# EAGLE design logic_swerve (EAGLE 9.5.0)

## Sheet 1 of 5: mBed Breakout
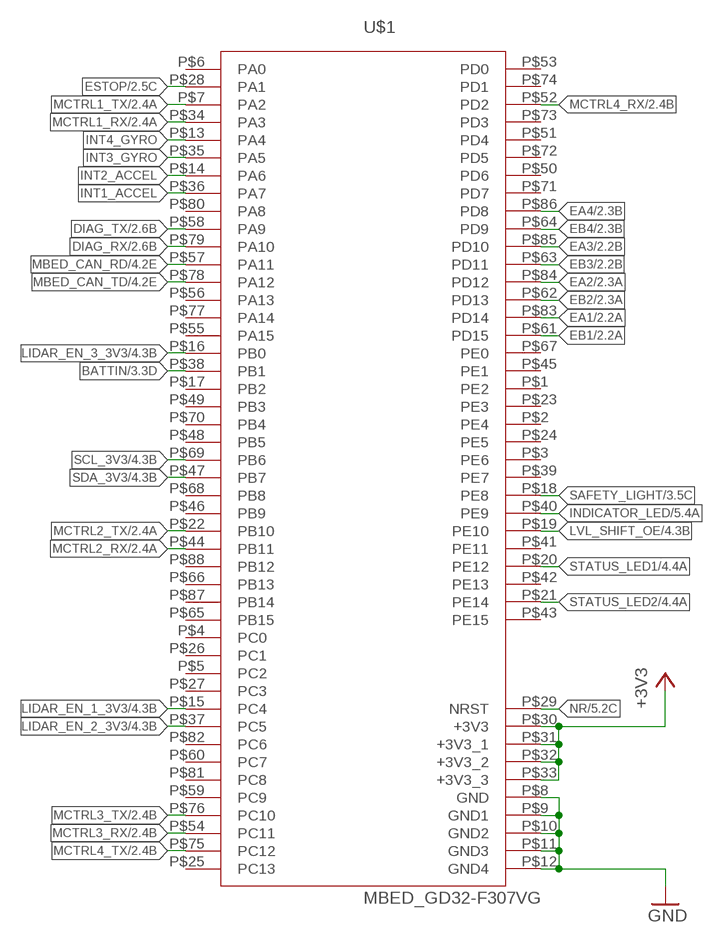
[diagram p0: schematic, sheet 1]

### Parts
U$1  MBED_GD32-F307VG  [SWERVE_MBED]

### Nets
+3V3: U$1.P$30(+3V3) U$1.P$31(+3V3_1) U$1.P$32(+3V3_2) U$1.P$33(+3V3_3) ; also sheet 3,5
BATTIN: U$1.P$38(PB1) ; also sheet 3
DIAG_RX: U$1.P$79(PA10) ; also sheet 2
DIAG_TX: U$1.P$58(PA9) ; also sheet 2
EA1: U$1.P$83(PD14) ; also sheet 2
EA2: U$1.P$84(PD12) ; also sheet 2
EA3: U$1.P$85(PD10) ; also sheet 2
EA4: U$1.P$86(PD8) ; also sheet 2
EB1: U$1.P$61(PD15) ; also sheet 2
EB2: U$1.P$62(PD13) ; also sheet 2
EB3: U$1.P$63(PD11) ; also sheet 2
EB4: U$1.P$64(PD9) ; also sheet 2
ESTOP: U$1.P$28(PA1) ; also sheet 2
GND: U$1.P$8(GND) U$1.P$9(GND1) U$1.P$10(GND2) U$1.P$11(GND3) U$1.P$12(GND4) ; also sheet 2,3,4,5
INDICATOR_LED: U$1.P$40(PE9) ; also sheet 5
INT1_ACCEL: U$1.P$36(PA7)
INT2_ACCEL: U$1.P$14(PA6)
INT3_GYRO: U$1.P$35(PA5)
INT4_GYRO: U$1.P$13(PA4)
LIDAR_EN_1_3V3: U$1.P$15(PC4) ; also sheet 4
LIDAR_EN_2_3V3: U$1.P$37(PC5) ; also sheet 4
LIDAR_EN_3_3V3: U$1.P$16(PB0) ; also sheet 4
LVL_SHIFT_OE: U$1.P$19(PE10) ; also sheet 4
MBED_CAN_RD: U$1.P$57(PA11) ; also sheet 4
MBED_CAN_TD: U$1.P$78(PA12) ; also sheet 4
MCTRL1_RX: U$1.P$34(PA3) ; also sheet 2
MCTRL1_TX: U$1.P$7(PA2) ; also sheet 2
MCTRL2_RX: U$1.P$44(PB11) ; also sheet 2
MCTRL2_TX: U$1.P$22(PB10) ; also sheet 2
MCTRL3_RX: U$1.P$54(PC11) ; also sheet 2
MCTRL3_TX: U$1.P$76(PC10) ; also sheet 2
MCTRL4_RX: U$1.P$52(PD2) ; also sheet 2
MCTRL4_TX: U$1.P$75(PC12) ; also sheet 2
NR: U$1.P$29(NRST) ; also sheet 5
SAFETY_LIGHT: U$1.P$18(PE8) ; also sheet 3
SCL_3V3: U$1.P$69(PB6) ; also sheet 4
SDA_3V3: U$1.P$47(PB7) ; also sheet 4
STATUS_LED1: U$1.P$20(PE12) ; also sheet 4
STATUS_LED2: U$1.P$21(PE14) ; also sheet 4
Unconnected: U$1.P$1(PE2) U$1.P$2(PE4) U$1.P$3(PE6) U$1.P$4(PC0) U$1.P$5(PC2) U$1.P$6(PA0) U$1.P$17(PB2) U$1.P$23(PE3) U$1.P$24(PE5) U$1.P$25(PC13) U$1.P$26(PC1) U$1.P$27(PC3) U$1.P$39(PE7) U$1.P$41(PE11) U$1.P$42(PE13) U$1.P$43(PE15) U$1.P$45(PE1) U$1.P$46(PB9) U$1.P$48(PB5) U$1.P$49(PB3) U$1.P$50(PD6) U$1.P$51(PD4) U$1.P$53(PD0) U$1.P$55(PA15) U$1.P$56(PA13) U$1.P$59(PC9) U$1.P$60(PC7) U$1.P$65(PB15) U$1.P$66(PB13) U$1.P$67(PE0) U$1.P$68(PB8) U$1.P$70(PB4) U$1.P$71(PD7) U$1.P$72(PD5) U$1.P$73(PD3) U$1.P$74(PD1) U$1.P$77(PA14) U$1.P$80(PA8) U$1.P$81(PC8) U$1.P$82(PC6) U$1.P$87(PB14) U$1.P$88(PB12)

## Sheet 2 of 5: Motor Control
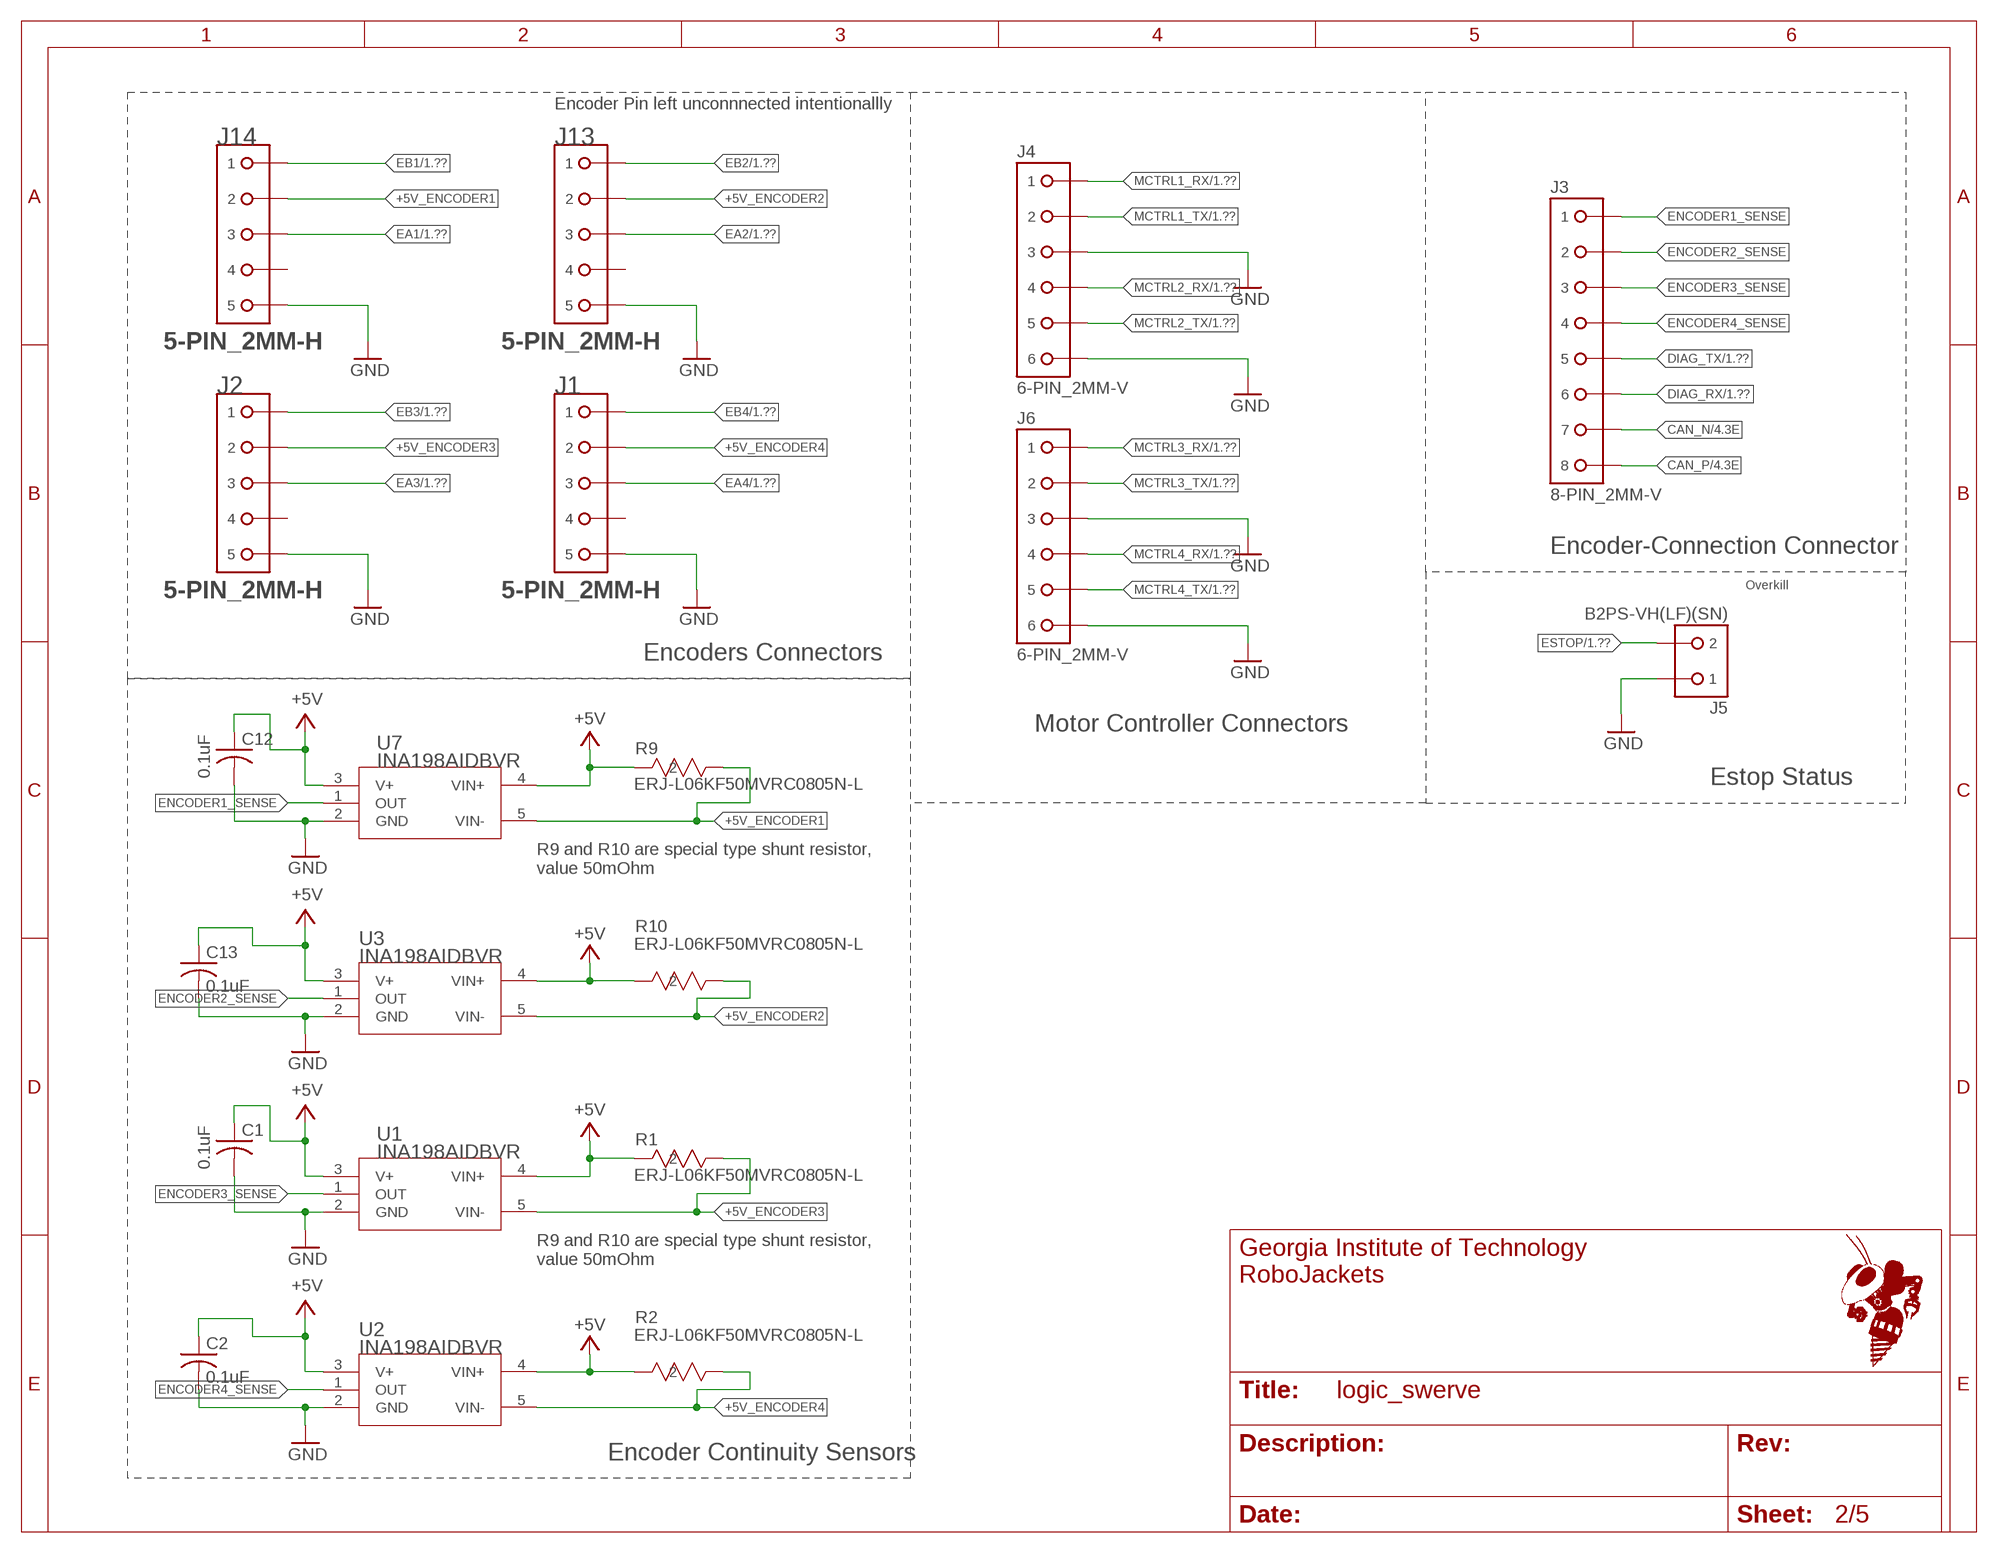
[diagram p1: schematic, sheet 2]

### Parts
C1  0.1uF  C-USC0603  [C0603]
C2  0.1uF  C-USC0603  [C0603]
C12  0.1uF  C-USC0603  [C0603]
C13  0.1uF  C-USC0603  [C0603]
J1  5-PIN_2MM-H  [2MM-5-H]
J2  5-PIN_2MM-H  [2MM-5-H]
J3  8-PIN_2MM-V  [2MM-8-V]
J4  6-PIN_2MM-V  [2MM-6-V]
J5  B2PS-VH(LF)(SN)  [B2PS-CENTERED]
J6  6-PIN_2MM-V  [2MM-6-V]
J13  5-PIN_2MM-H  [2MM-5-H]
J14  5-PIN_2MM-H  [2MM-5-H]
R1  ERJ-L06KF50MVRC0805N-L  [RC0805N-L]
R2  ERJ-L06KF50MVRC0805N-L  [RC0805N-L]
R9  ERJ-L06KF50MVRC0805N-L  [RC0805N-L]
R10  ERJ-L06KF50MVRC0805N-L  [RC0805N-L]
U1  INA198AIDBVR  [DBV5]
U2  INA198AIDBVR  [DBV5]
U3  INA198AIDBVR  [DBV5]
U7  INA198AIDBVR  [DBV5]

### Nets
+5V: C1.1 C2.1 C12.1 C13.1 R1.2 R2.2 R9.2 R10.2 U1.3(V+) U1.4(VIN+) U2.3(V+) U2.4(VIN+) U3.3(V+) U3.4(VIN+) U7.3(V+) U7.4(VIN+) ; also sheet 3,4,5
+5V_ENCODER1: J14.2 R9.1 U7.5(VIN-)
+5V_ENCODER2: J13.2 R10.1 U3.5(VIN-)
+5V_ENCODER3: J2.2 R1.1 U1.5(VIN-)
+5V_ENCODER4: J1.2 R2.1 U2.5(VIN-)
CAN_N: J3.7 ; also sheet 4
CAN_P: J3.8 ; also sheet 4
DIAG_RX: J3.6 ; also sheet 1
DIAG_TX: J3.5 ; also sheet 1
EA1: J14.3 ; also sheet 1
EA2: J13.3 ; also sheet 1
EA3: J2.3 ; also sheet 1
EA4: J1.3 ; also sheet 1
EB1: J14.1 ; also sheet 1
EB2: J13.1 ; also sheet 1
EB3: J2.1 ; also sheet 1
EB4: J1.1 ; also sheet 1
ENCODER1_SENSE: J3.1 U7.1(OUT)
ENCODER2_SENSE: J3.2 U3.1(OUT)
ENCODER3_SENSE: J3.3 U1.1(OUT)
ENCODER4_SENSE: J3.4 U2.1(OUT)
ESTOP: J5.2 ; also sheet 1
GND: C1.2 C2.2 C12.2 C13.2 J1.5 J2.5 J4.3 J4.6 J5.1 J6.3 J6.6 J13.5 J14.5 U1.2(GND) U2.2(GND) U3.2(GND) U7.2(GND) ; also sheet 1,3,4,5
MCTRL1_RX: J4.1 ; also sheet 1
MCTRL1_TX: J4.2 ; also sheet 1
MCTRL2_RX: J4.4 ; also sheet 1
MCTRL2_TX: J4.5 ; also sheet 1
MCTRL3_RX: J6.1 ; also sheet 1
MCTRL3_TX: J6.2 ; also sheet 1
MCTRL4_RX: J6.4 ; also sheet 1
MCTRL4_TX: J6.5 ; also sheet 1
Unconnected: J1.4 J2.4 J13.4 J14.4

### Notes on the sheet
- Encoder Pin left unconnnected intentionallly
- Encoder-Connection Connector
- Overkill
- Encoders Connectors
- Motor Controller Connectors
- Estop Status
- R9 and R10 are special type shunt resistor,
  value 50mOhm
- R9 and R10 are special type shunt resistor,
  value 50mOhm
- Encoder Continuity Sensors

## Sheet 3 of 5: Light Control
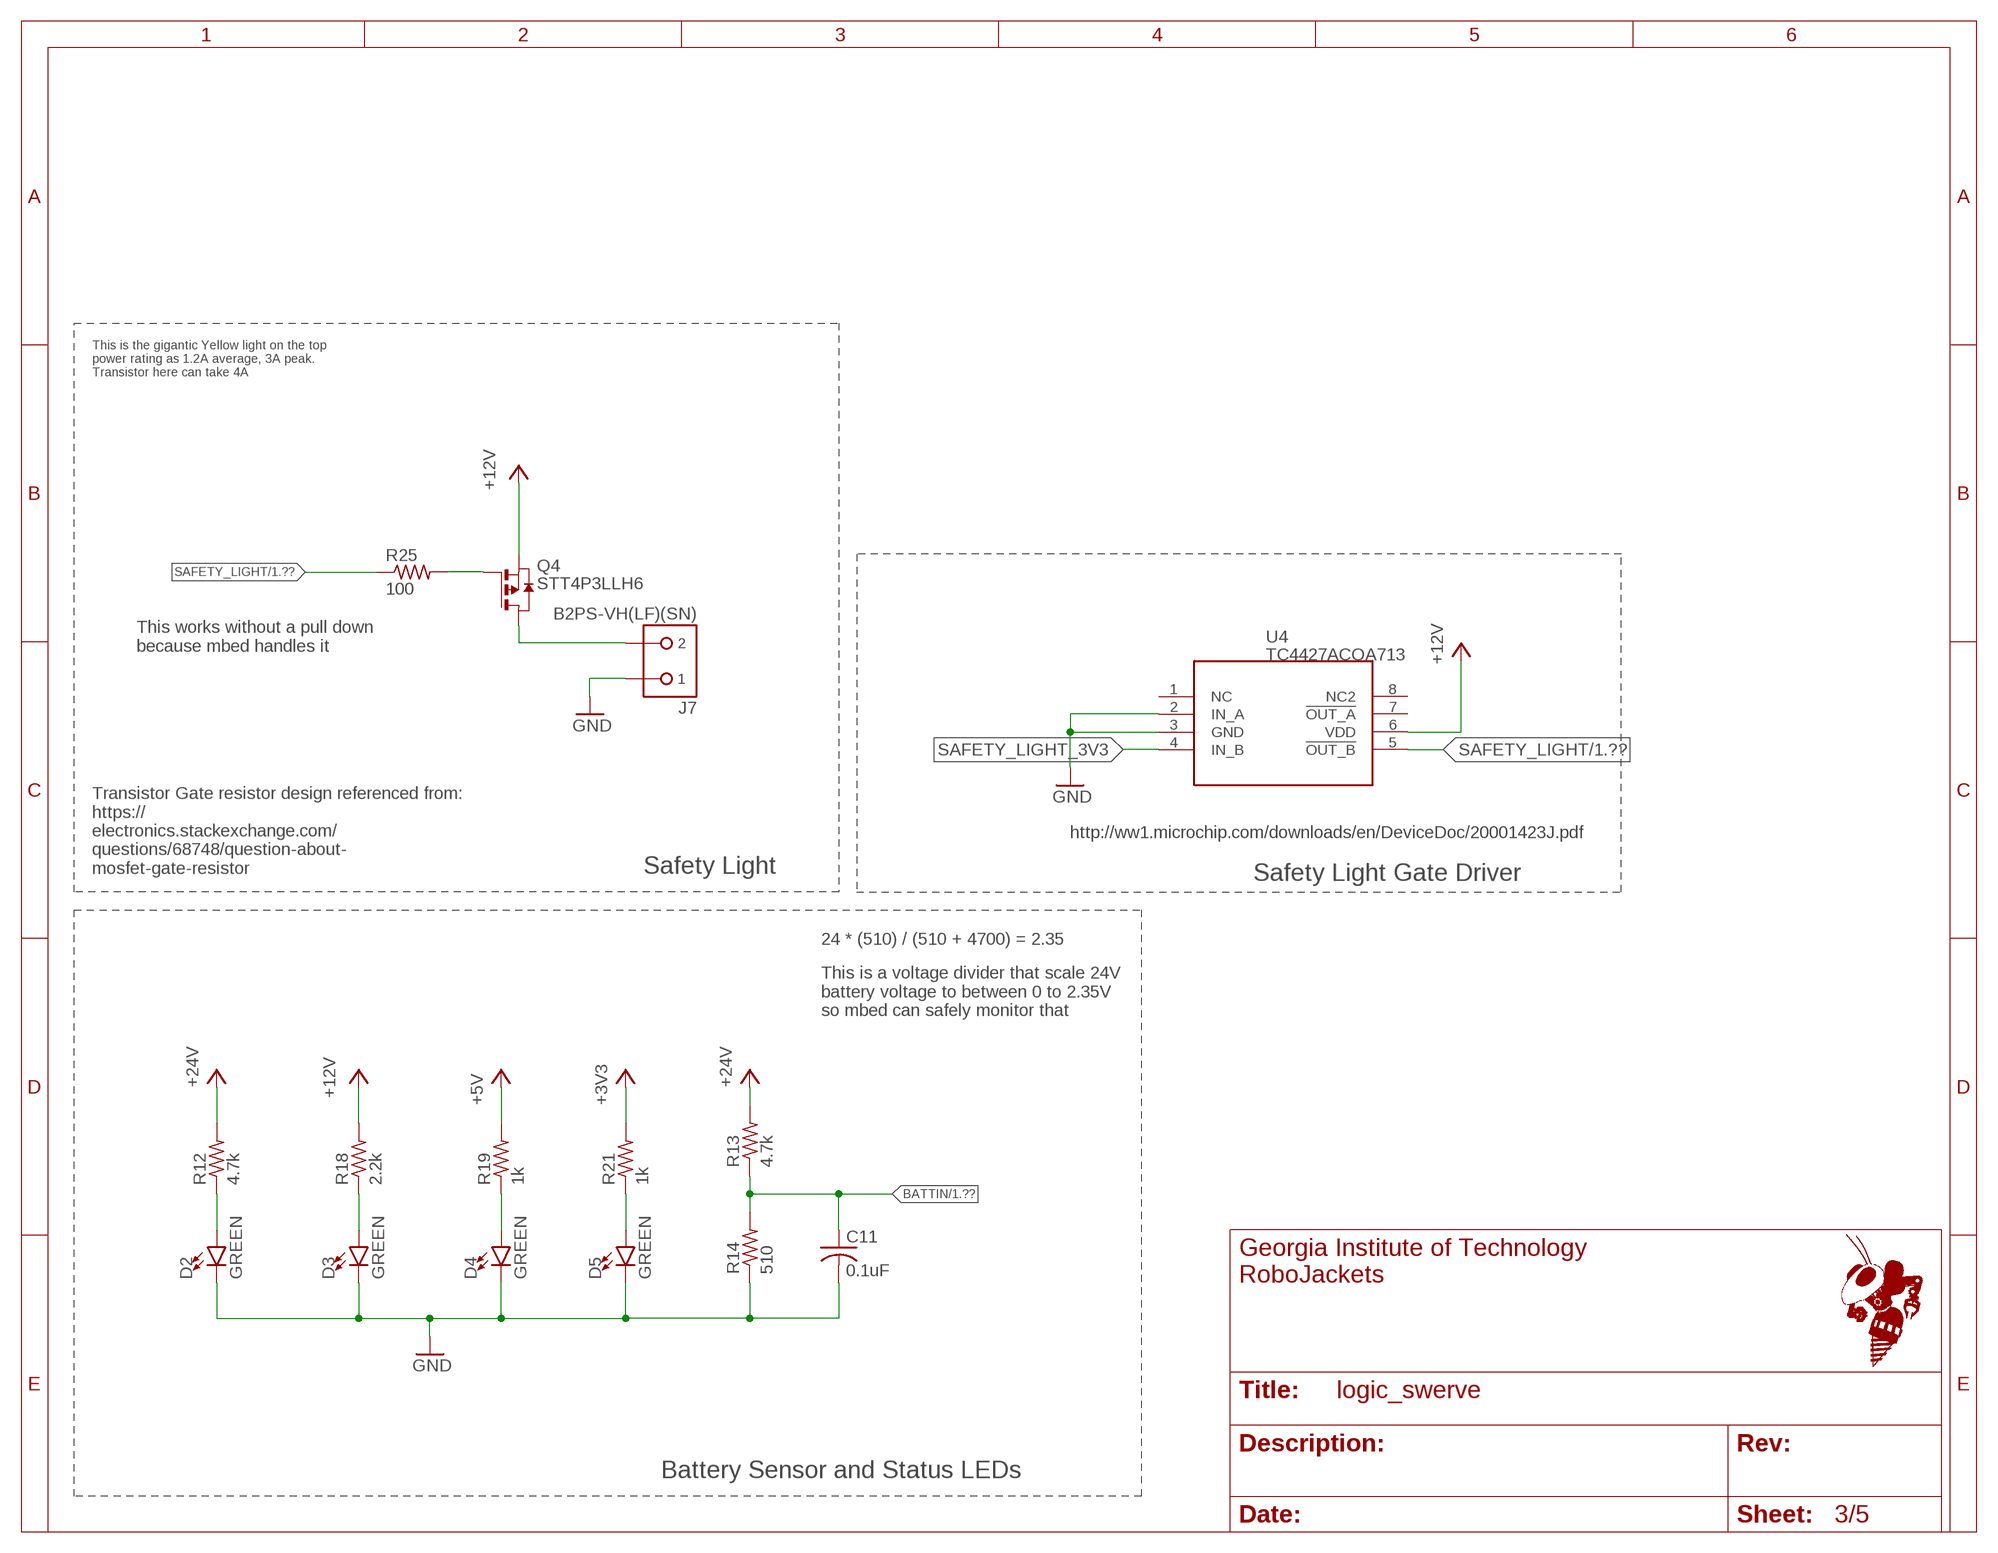
[diagram p2: schematic, sheet 3]

### Parts
C11  0.1uF  C-USC0603  [C0603]
D2  GREEN  LED-BLUE0603  [LED-0603]
D3  GREEN  LED-BLUE0603  [LED-0603]
D4  GREEN  LED-GREEN0603  [LED-0603]
D5  GREEN  LED-GREEN0603  [LED-0603]
J7  B2PS-VH(LF)(SN)  [B2PS-CENTERED]
Q4  STT4P3LLH6  [SOT23-6]
R12  4.7k  R-US_R0603  [R0603]
R13  4.7k  R-US_R0603  [R0603]
R14  510  R-US_R0603  [R0603]
R18  2.2k  R-US_R0603  [R0603]
R19  1k  R-US_R0603  [R0603]
R21  1k  R-US_R0603  [R0603]
R25  100  R-US_R0603  [R0603]
U4  TC4427ACOA713  [SOIC-8]

### Nets
3V3_LED_R: D5.A R21.1
5V_LED_R: D4.A R19.1
12V_LED_R: D3.A R18.1
+3V3: R21.2 ; also sheet 1,5
+5V: R19.2 ; also sheet 2,4,5
+12V: Q4.4(S) R18.2 U4.6(VDD) ; also sheet 5
+24V: R12.2 R13.2 ; also sheet 5
BATTIN: C11.1 R13.1 R14.2 ; also sheet 1
GND: C11.2 D2.C D3.C D4.C D5.C J7.1 R14.1 U4.2(IN_A) U4.3(GND) ; also sheet 1,2,4,5
N$1: D2.A R12.1
SAFETY_HRD: J7.2 Q4.1(D) Q4.2(D) Q4.5(D) Q4.6(D)
SAFETY_LIGHT: R25.1 U4.5(!OUT_B) ; also sheet 1
SAFETY_LIGHT_3V3: U4.4(IN_B)
SAFETY_R: Q4.3(G) R25.2
Unconnected: U4.1(NC) U4.7(!OUT_A) U4.8(NC2)

### Notes on the sheet
- This is the gigantic Yellow light on the top
  power rating as 1.2A average, 3A peak.
  Transistor here can take 4A
- This works without a pull down
  because mbed handles it
- http://ww1.microchip.com/downloads/en/DeviceDoc/20001423J.pdf
- Transistor Gate resistor design referenced from:
  https://
  electronics.stackexchange.com/
  questions/68748/question-about-
  mosfet-gate-resistor
- Safety Light
- Safety Light Gate Driver
- 24 * (510) / (510 + 4700) = 2.35
- This is a voltage divider that scale 24V
  battery voltage to between 0 to 2.35V
  so mbed can safely monitor that
- Battery Sensor and Status LEDs

## Sheet 4 of 5: Sensor and Comm
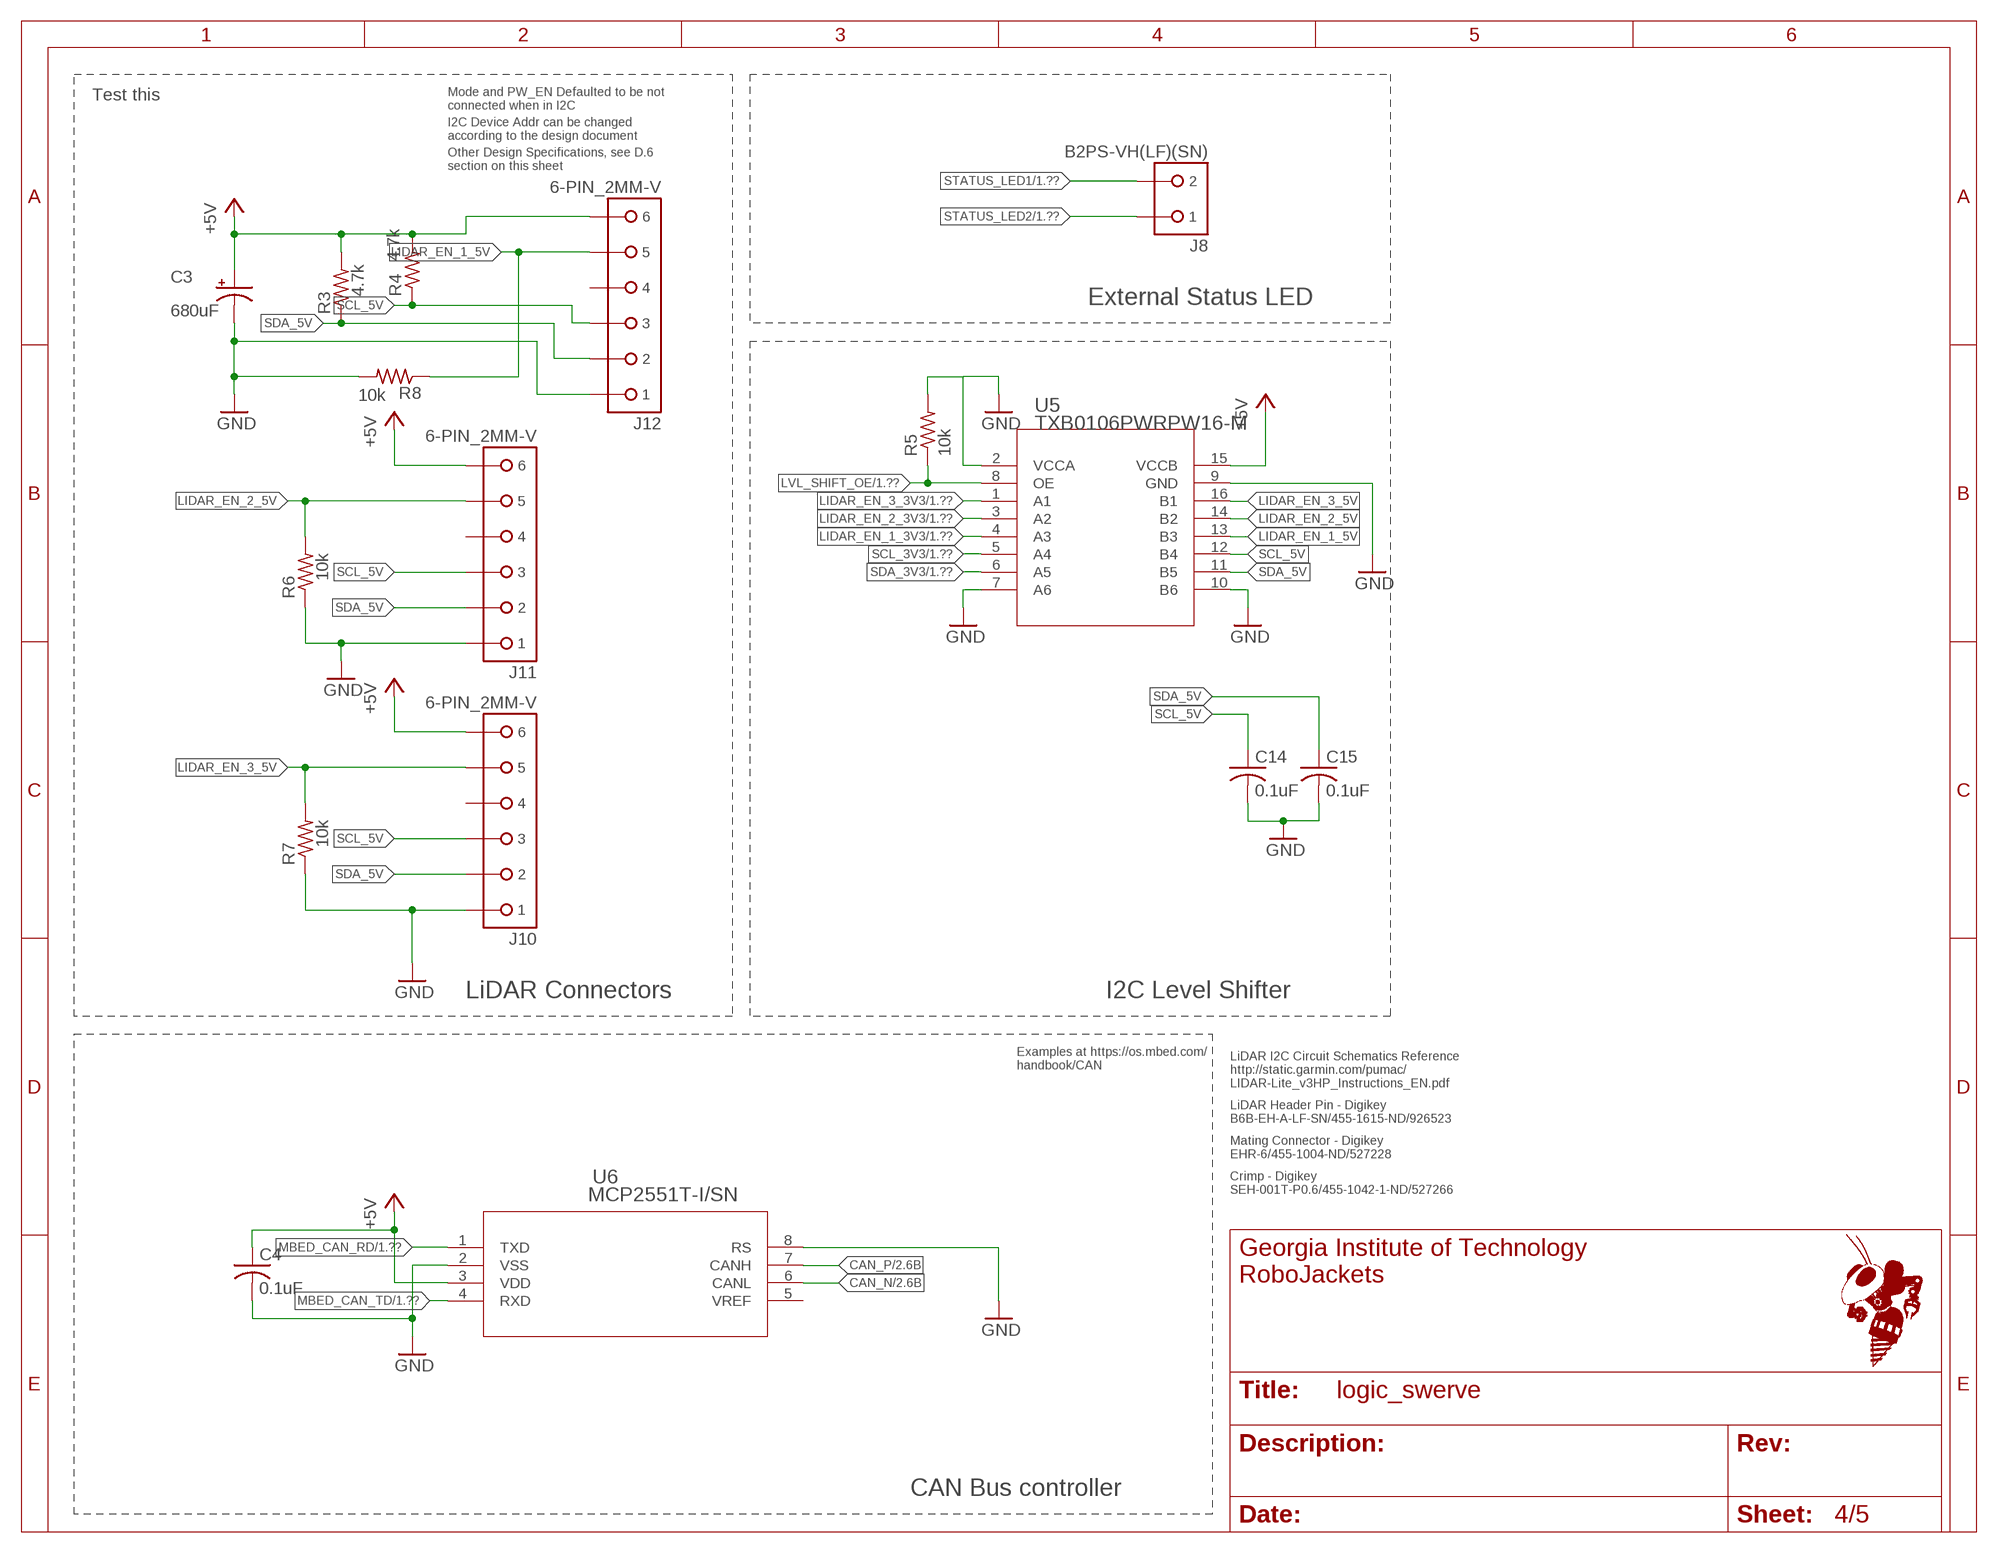
[diagram p3: schematic, sheet 4]

### Parts
C3  680uF  CPOL-USE5-5  [E5-5]
C4  0.1uF  C-USC0603  [C0603]
C14  0.1uF  C-USC0603  [C0603]
C15  0.1uF  C-USC0603  [C0603]
J8  B2PS-VH(LF)(SN)  [B2PS-CENTERED]
J10  6-PIN_2MM-V  [2MM-6-V]
J11  6-PIN_2MM-V  [2MM-6-V]
J12  6-PIN_2MM-V  [2MM-6-V]
R3  4.7k  R-US_R0603  [R0603]
R4  4.7k  R-US_R0603  [R0603]
R5  10k  R-US_R0603  [R0603]
R6  10k  R-US_R0603  [R0603]
R7  10k  R-US_R0603  [R0603]
R8  10k  R-US_R0603  [R0603]
U5  TXB0106PWRPW16-M  [PW16-M]
U6  MCP2551T-I/SN  [SOIC8-N_MC]

### Nets
+5V: C3.+ C4.1 J10.6 J11.6 J12.6 R3.2 R4.2 U5.15(VCCB) U6.3(VDD) ; also sheet 2,3,5
CAN_N: U6.6(CANL) ; also sheet 2
CAN_P: U6.7(CANH) ; also sheet 2
GND: C3.- C4.2 C14.2 C15.2 J10.1 J11.1 J12.1 R5.2 R6.1 R7.1 R8.2 U5.2(VCCA) U5.7(A6) U5.9(GND) U5.10(B6) U6.2(VSS) U6.8(RS) ; also sheet 1,2,3,5
LIDAR_EN_1_3V3: U5.4(A3) ; also sheet 1
LIDAR_EN_1_5V: J12.5 R8.1 U5.13(B3)
LIDAR_EN_2_3V3: U5.3(A2) ; also sheet 1
LIDAR_EN_2_5V: J11.5 R6.2 U5.14(B2)
LIDAR_EN_3_3V3: U5.1(A1) ; also sheet 1
LIDAR_EN_3_5V: J10.5 R7.2 U5.16(B1)
LVL_SHIFT_OE: R5.1 U5.8(OE) ; also sheet 1
MBED_CAN_RD: U6.1(TXD) ; also sheet 1
MBED_CAN_TD: U6.4(RXD) ; also sheet 1
SCL_3V3: U5.5(A4) ; also sheet 1
SCL_5V: C14.1 J10.3 J11.3 J12.3 R4.1 U5.12(B4)
SDA_3V3: U5.6(A5) ; also sheet 1
SDA_5V: C15.1 J10.2 J11.2 J12.2 R3.1 U5.11(B5)
STATUS_LED1: J8.2 ; also sheet 1
STATUS_LED2: J8.1 ; also sheet 1
Unconnected: J10.4 J11.4 J12.4 U6.5(VREF)

### Notes on the sheet
- Test this
- Mode and PW_EN Defaulted to be not
  connected when in I2C
- I2C Device Addr can be changed
  according to the design document
- Other Design Specifications, see D.6
  section on this sheet
- External Status LED
- LiDAR Connectors | I2C Level Shifter
- Examples at https://os.mbed.com/
  handbook/CAN
- LiDAR I2C Circuit Schematics Reference
  http://static.garmin.com/pumac/
  LIDAR-Lite_v3HP_Instructions_EN.pdf
- LiDAR Header Pin - Digikey
  B6B-EH-A-LF-SN/455-1615-ND/926523
- Mating Connector - Digikey
  EHR-6/455-1004-ND/527228
- Crimp - Digikey
  SEH-001T-P0.6/455-1042-1-ND/527266
- CAN Bus controller

## Sheet 5 of 5: Misc
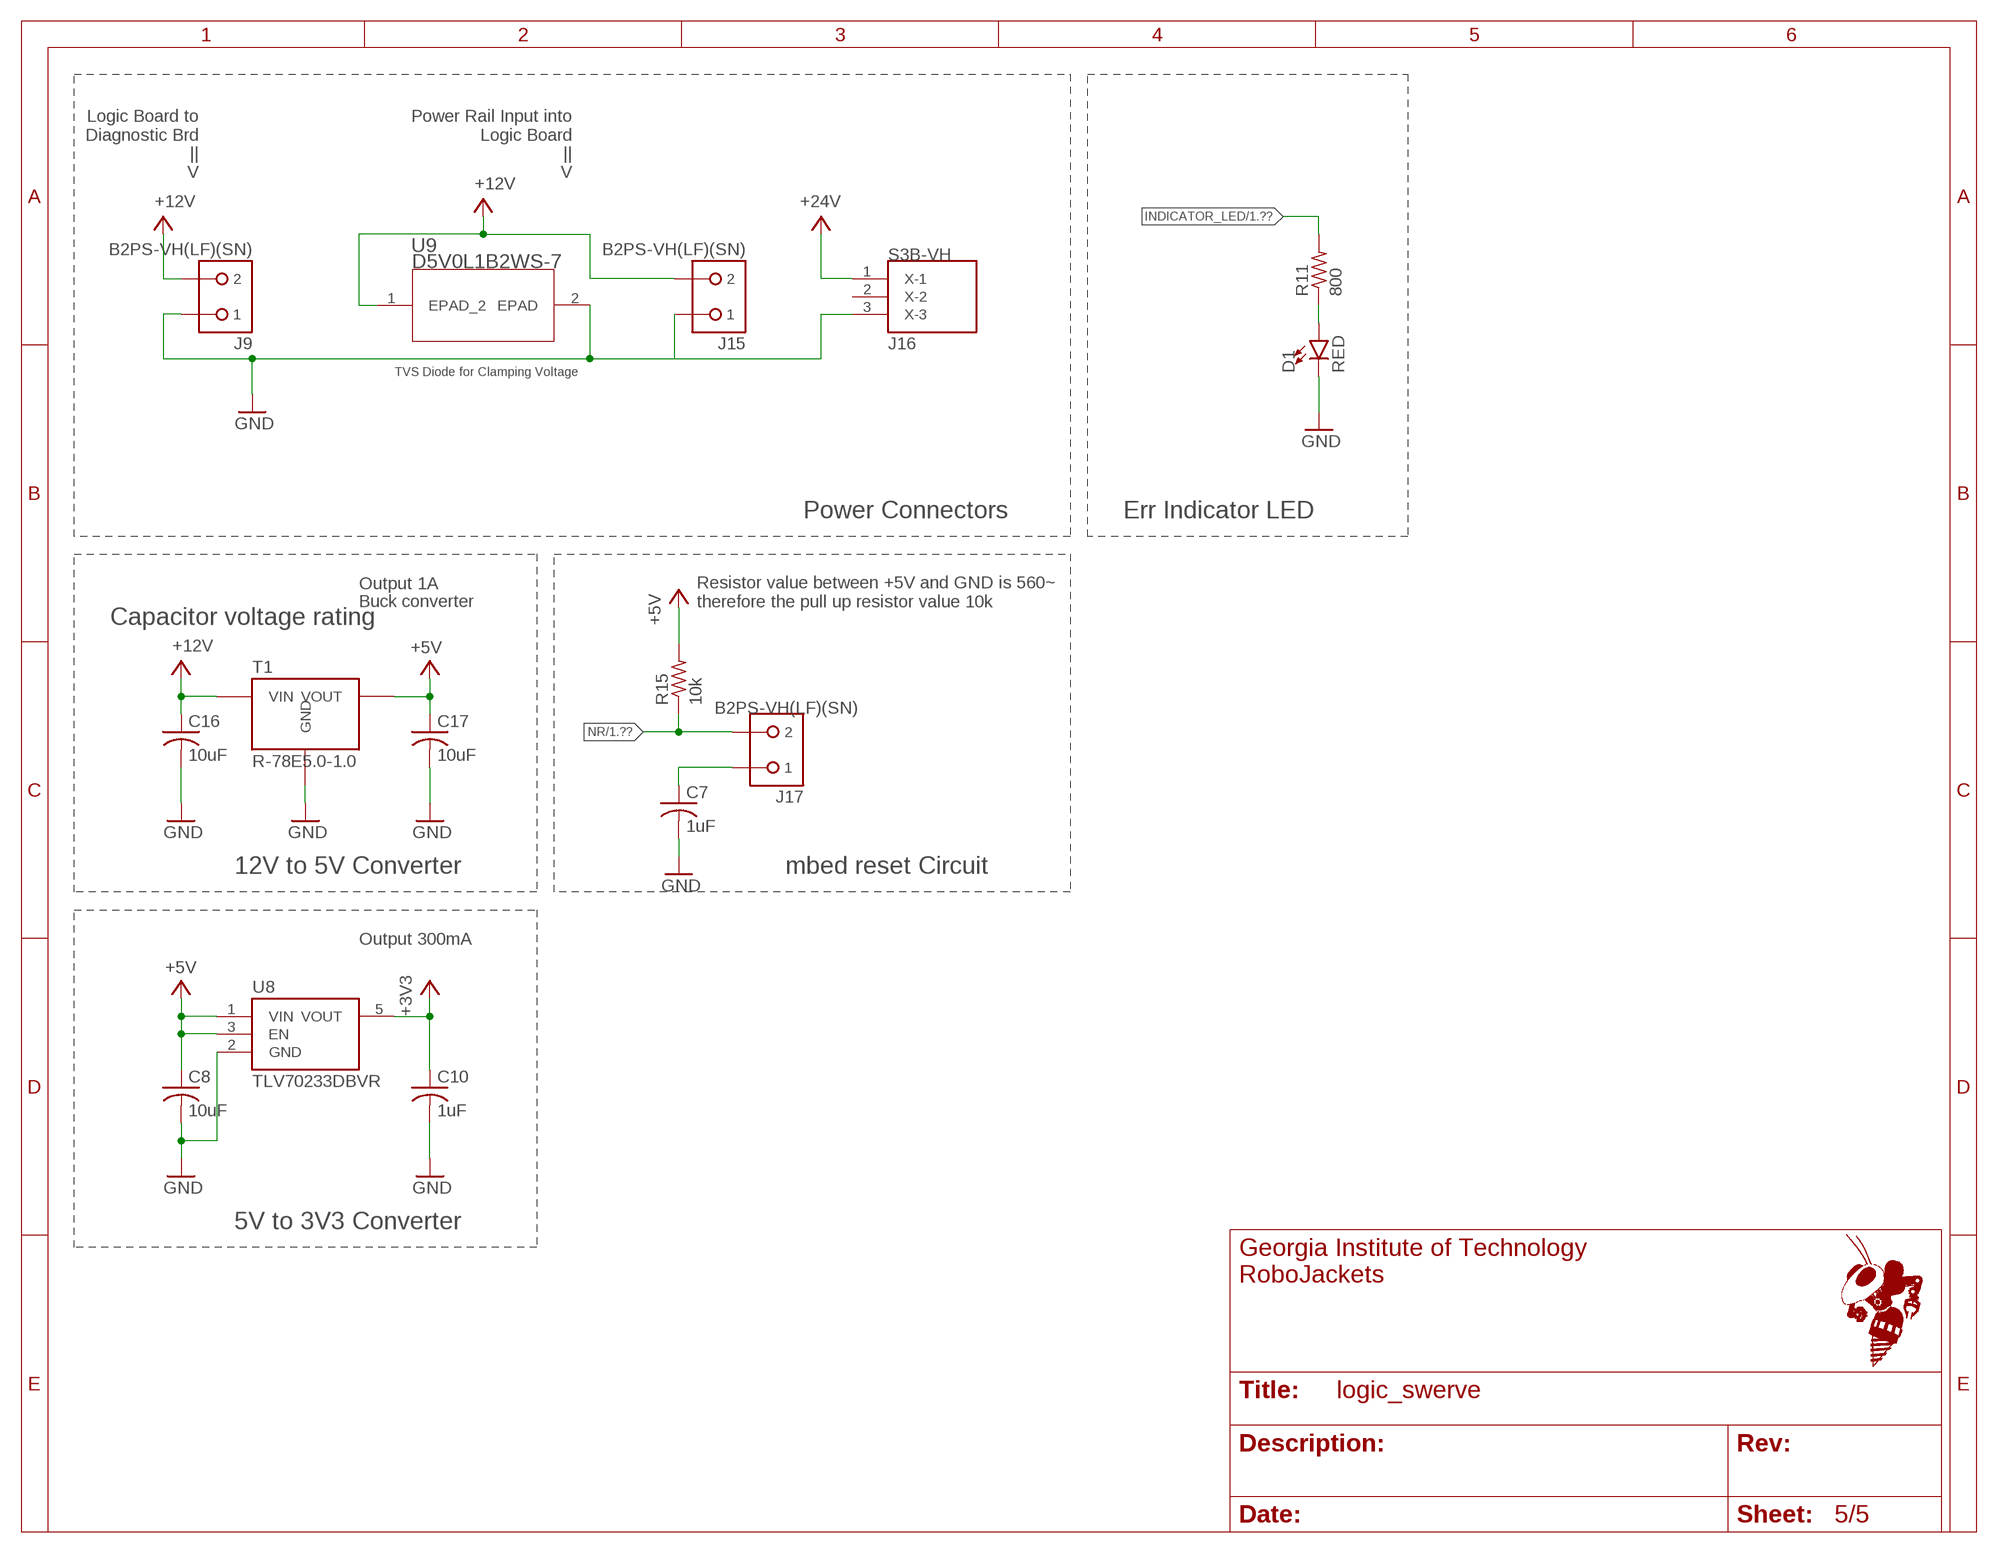
[diagram p4: schematic, sheet 5]

### Parts
C7  1uF  C-USC0805  [C0805]
C8  10uF  C-USC0805  [C0805]
C10  1uF  C-USC0805  [C0805]
C16  10uF  C-USC0805  [C0805]
C17  10uF  C-USC0805  [C0805]
D1  RED  LED-BLUE0603  [LED-0603]
J9  B2PS-VH(LF)(SN)  [B2PS-CENTERED]
J15  B2PS-VH(LF)(SN)  [B2PS-CENTERED]
J16  S3B-VH  [S3B-VH]
J17  B2PS-VH(LF)(SN)  [B2PS-CENTERED]
R11  800  R-US_R0603  [R0603]
R15  10k  R-US_R0603  [R0603]
T1  R-78E5.0-1.0  [R-78E]
U8  TLV70233DBVR  [SOT-23-5]
U9  D5V0L1B2WS-7  [SOD323]

### Nets
+3V3: C10.1 U8.5(VOUT) ; also sheet 1,3
+5V: C8.1 C17.1 R15.2 T1.3(VOUT) U8.1(VIN) U8.3(EN) ; also sheet 2,3,4
+12V: C16.1 J9.2 J15.2 T1.1(VIN) U9.1(EPAD_2) ; also sheet 3
+24V: J16.1(X-1) ; also sheet 3
GND: C7.2 C8.2 C10.2 C16.2 C17.2 D1.C J9.1 J15.1 J16.3(X-3) T1.2(GND) U8.2(GND) U9.2(EPAD) ; also sheet 1,2,3,4
INDICATOR_LED: R11.2 ; also sheet 1
N$2: D1.A R11.1
N$3: C7.1 J17.1
NR: J17.2 R15.1 ; also sheet 1
Unconnected: J16.2(X-2)

### Notes on the sheet
- Logic Board to
  Diagnostic Brd
               ||
               V
- Power Rail Input into
  Logic Board
               ||
               V
- TVS Diode for Clamping Voltage
- Power Connectors | Err Indicator LED
- Output 1A
- Buck converter
- Resistor value between +5V and GND is 560~
  therefore the pull up resistor value 10k
- Capacitor voltage rating
- 12V to 5V Converter | mbed reset Circuit
- Output 300mA
- 5V to 3V3 Converter

## Library data of the parts
C1 C2 C4 C7 C8 C10-C17 = rcl:C-US: CAPACITOR, American symbol; SPICEPREFIX: C
C3 = rcl:CPOL-US: POLARIZED CAPACITOR, American symbol; SPICEPREFIX: C
D1-D3 = SparkFun-LED:LED-BLUE: Blue SMD LED Used in manufacturing of various products at SparkFun Packages: 0603 - SMD 0603 package [Product Link] <http://www.digikey.com/product-detail/en/SMLE12BC7TT86/511-1589-2-ND/1641808> 1206 - SMD1206 package [Product Link] <http://www.digikey.com/product-detail/en/lite-on-inc/LTST-C150TBKT/160-1643-1-ND/573584> SparkFun Products: ESP8266 Thing-Dev Board <https://www.sparkfun.com/products/13711> RedBoard <https://www.sparkfun.com/products/12757>; PROD_ID: DIO-08575; VALUE: BLUE
D4 D5 = SparkFun-LED:LED-GREEN: Green SMD LED Used in manufacturing of various products at SparkFun Packages: 0603 - SMD 0603 package [Product Link] <http://www.futureelectronics.com/en/technologies/semiconductors/optoelectronics/leds/Pages/9894312-LTST-C190GKT.aspx?CrossPart=HSMG-C190&IM=0> LilyPad 1206 - SMD1206 LilyPad package [Product Link] <http://www.futureelectronics.com/en/Technologies/Product.aspx?ProductID=IN150NGHARVATEKCORPORATION2049943&IM=0> 1206 - SMD1206 package [Product Link] <http://www.futureelectronics.com/en/technologies/semiconductors/optoelectronics/leds/Pages/8315665-LTST-C150KGKT.aspx?IM=0> 1206 Bottom Mount -SMD 1206 Bottom Mount [Product Link] <http://www.digikey.com/product-detail/en/lite-on-inc/LTST-C230KGKT/160-1456-1-ND/386854> SparkFun Products: Pro Mini 328 -5V <https://www.sparkfun.com/products/821> RedBoard <https://www.sparkfun.com/products/12757> MP3 Trigger <https://www.sparkfun.com/products/13720> Makey Makey <https://www.sparkfun.com/products/11076>; PROD_ID: DIO-00821
J1 J2 J13 J14 = RoboJackets-Connectors:5-PIN_2MM-*; PINS: 5; PIN_PITCH: 2.0 mm
J3 = RoboJackets-Connectors:8-PIN_2MM-*; PINS: 8; PIN_PITCH: 2.0 mm
J4 J6 J10-J12 = RoboJackets-Connectors:6-PIN_2MM-*; PINS: 6; PIN_PITCH: 2.0 mm
J5 J7-J9 J15 J17 = RoboJackets-Connectors:B2P?-VH(LF)(SN): Power Connector Brand: JST Sales America Inc. <https://www.jst.com/> Series: VH <http://www.digikey.com/product-search/en?FV=fff40016,fff802f3,ffec0e9d> Distributor: Digi-Key <http://www.digikey.com/product-detail/en/B2PS-VH%28LF%29%28SN%29/455-1648-ND/926555>; DIGIKEY: 455-1648-ND; MPN: B2PS-VH(LF)(SN)
J16 = IGVC-Connector:S3B-VH
Q4 = MotorBoardDev:STT4P3LLH6
R1 R2 R9 R10 = IGVC-Discrete:ERJ-L06KF50MV; MANUFACTURER_PART_NUMBER: ERJL06KF50MV; VENDOR: Panasonic
R3-R8 R11-R15 R18 R19 R21 R25 = rcl:R-US_: RESISTOR, American symbol; SPICEPREFIX: R
T1 = MotorBoardDev:R-78E5.0-1.0
U1-U3 U7 = IGVC-Sensor:INA198AIDBVR; MANUFACTURER_PART_NUMBER: INA198AIDBVR; VENDOR: Texas Instruments
U4 = MotorBoardDev:TC4427ACOA713
U5 = IGVC-IC:TXB0106PWR; MANUFACTURER_PART_NUMBER: TXB0106PWR; VENDOR: Texas Instruments
U6 = IGVC-Microcontroller:MCP2551T-I/SN; MANUFACTURER_PART_NUMBER: MCP2551TISN; VENDOR: Microchip
U8 = RoboJackets-PowerICs:TLV70233; DIGIKEY: 296-32415-1-ND; MPN: TLV70233DBVR
U9 = IGVC-Discrete:D5V0L1B2WS-7; BUILT_BY: EMA_UL_Team; MANUFACTURER_PART_NUMBER: D5V0L1B2WS-7; VENDOR: Diodes Inc
U$1 = RoboJackets-Boards:MBED_GD32-F307VG

## Board
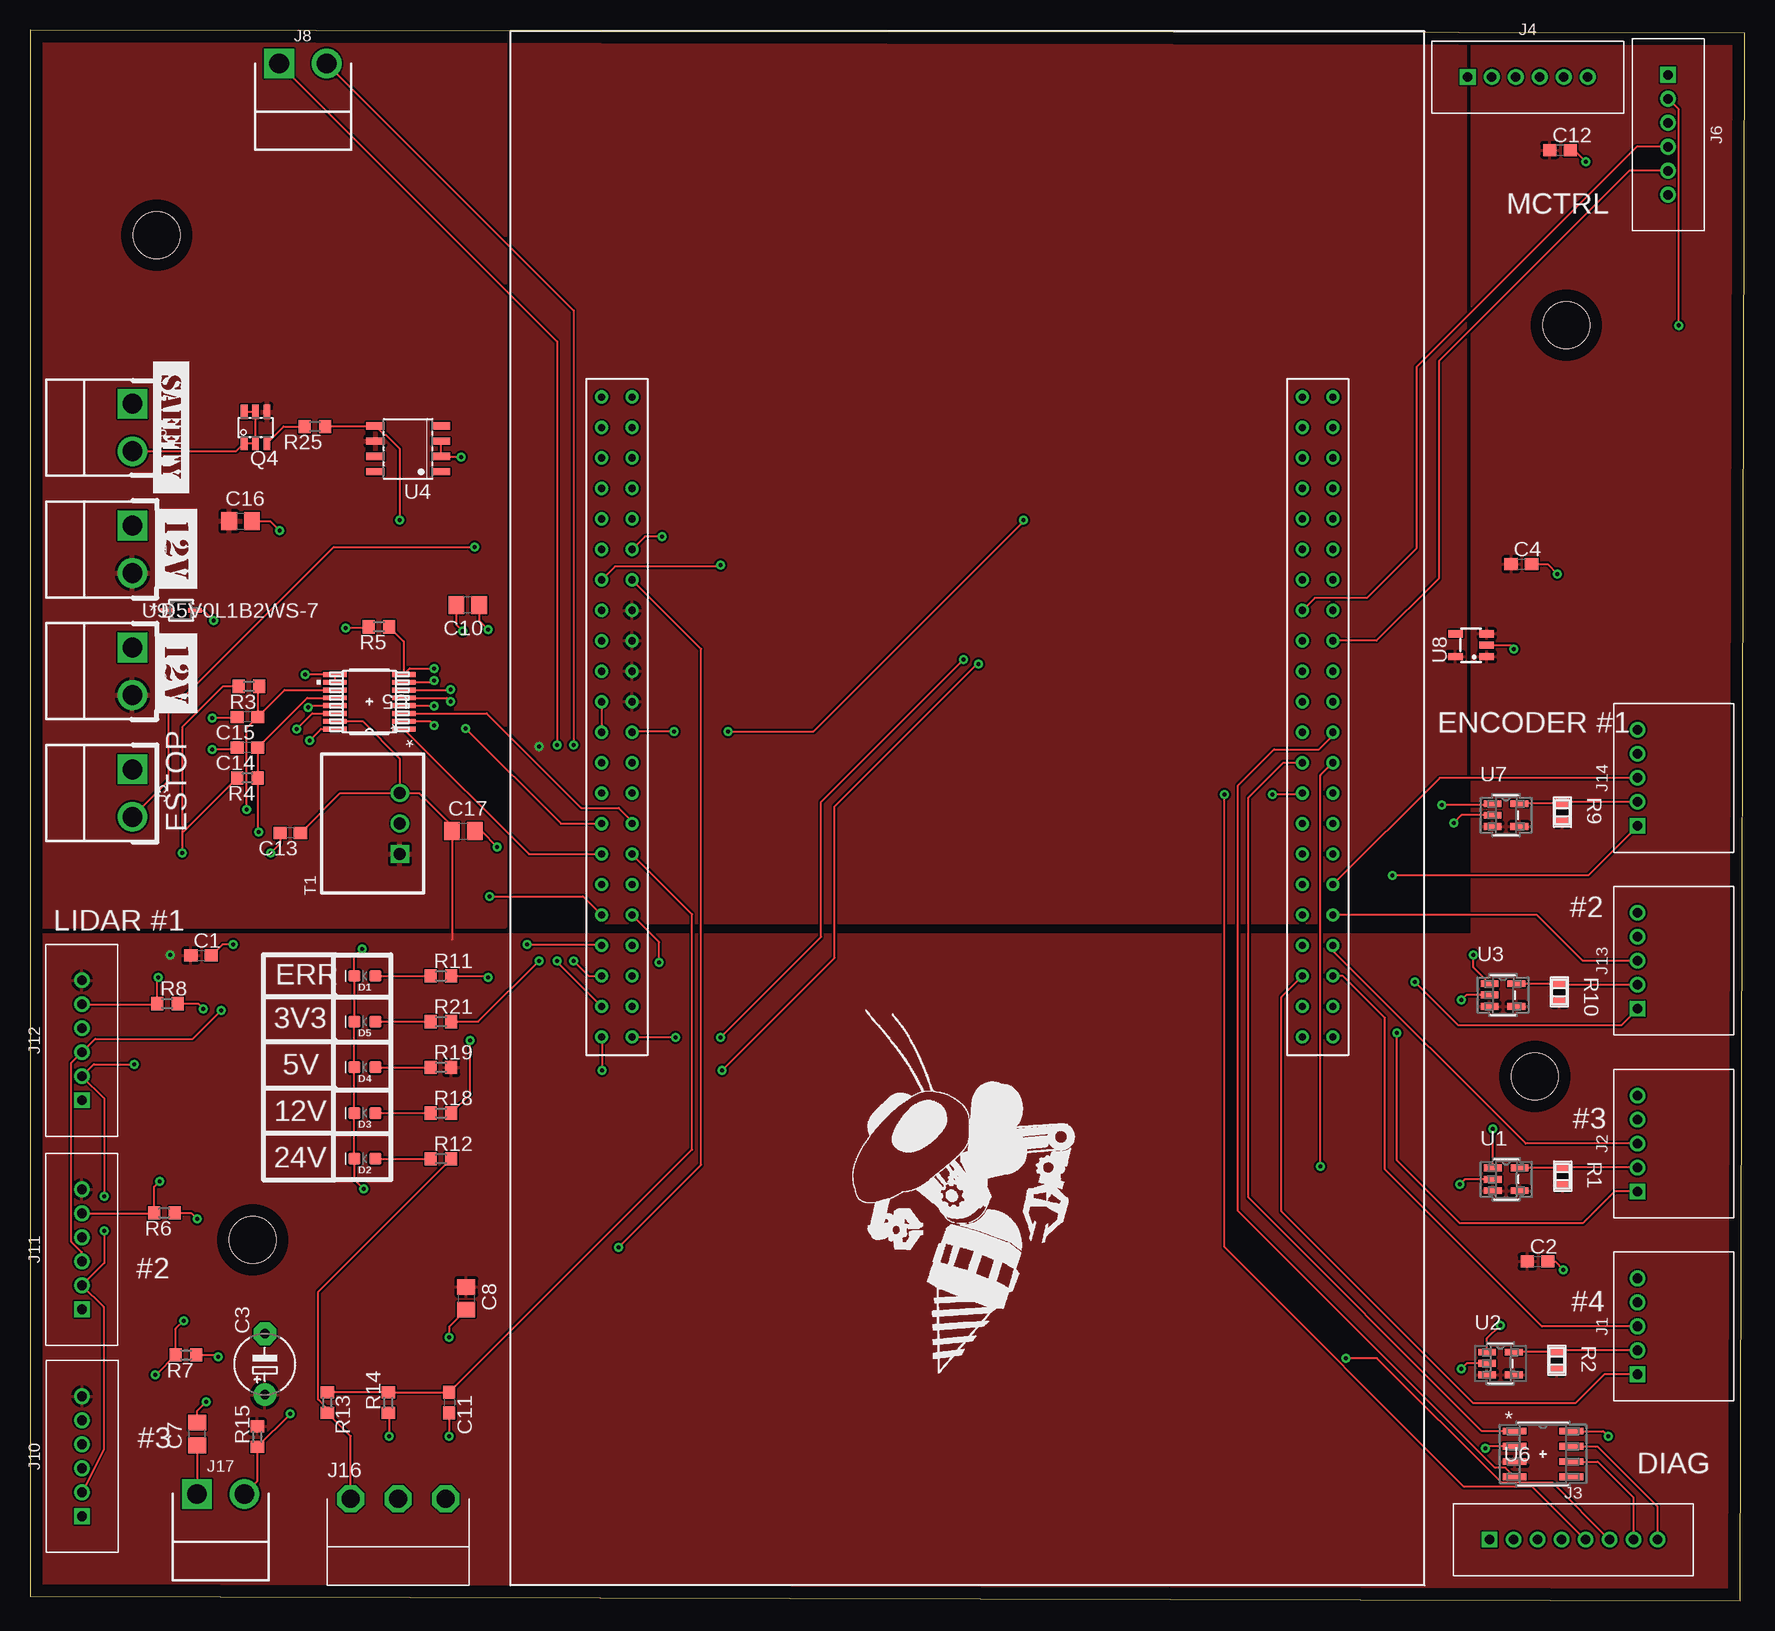
[diagram p5: board, top side]
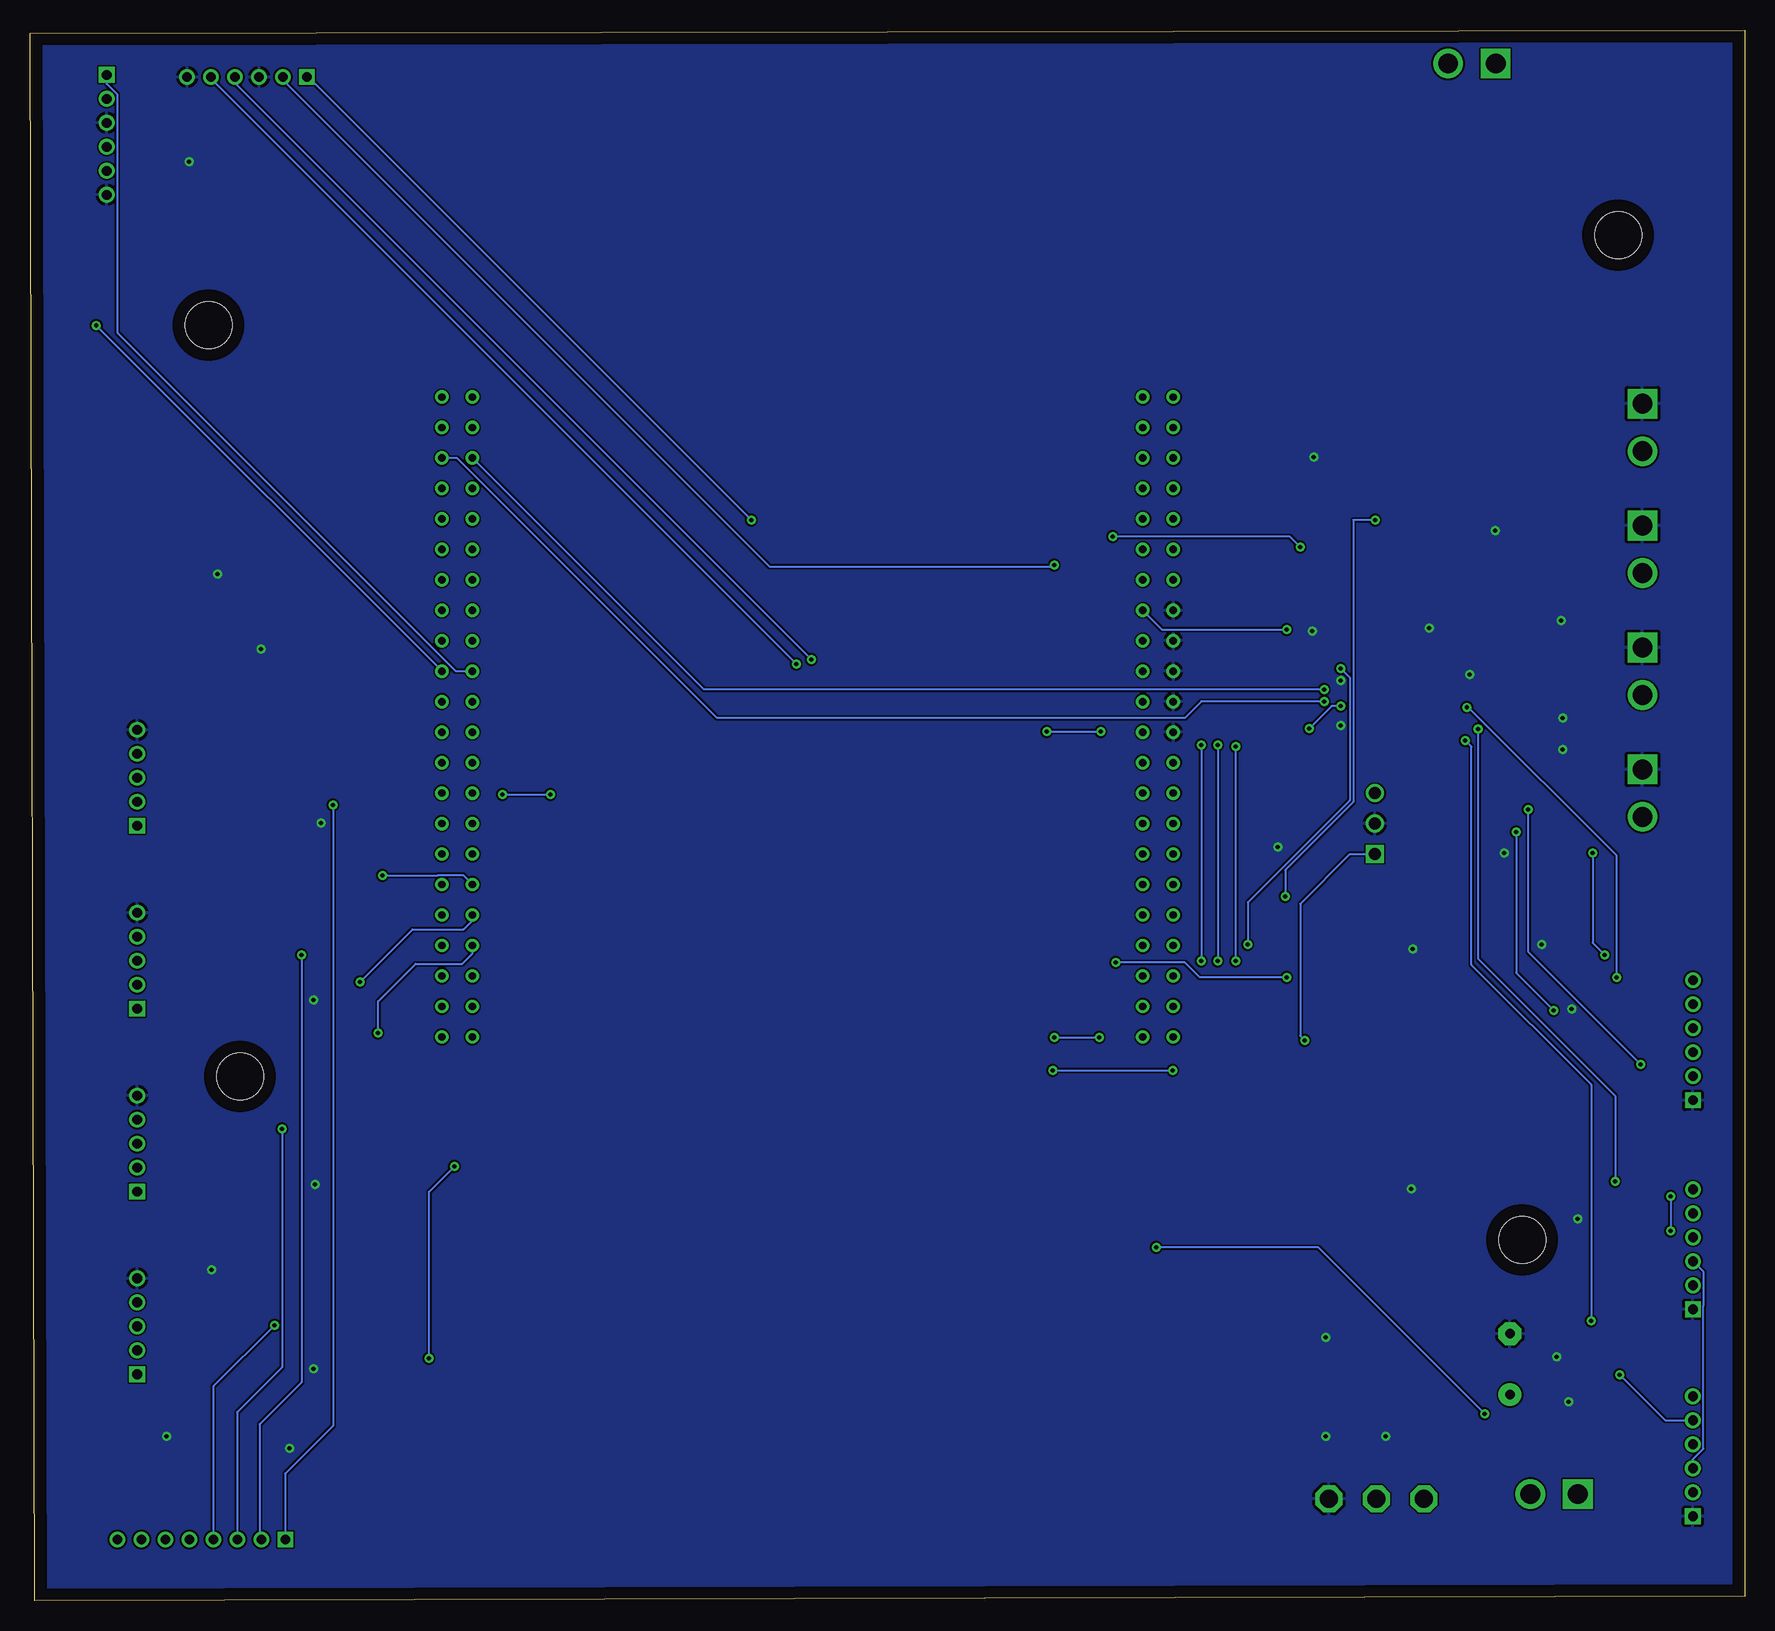
[diagram p6: board, bottom side, seen from below]

Size 142.94 x 130.93 mm. Coordinates in mm from the lower left corner, seen from the top.
Outline: 0,0.38 142.57,0 142.94,130.68 0,130.93 0,0.38
Copper layers (1*16): Top 0.035mm / dielectric 1.5mm / Bottom 0.035mm
Design rules "default": minimum track width 6mil, minimum drill 0.35mm, track to track 6mil, track to pad 6mil, pad to pad 6mil, via to via 6mil, smd to smd 6mil, copper to edge 40mil, drill to drill 6mil, minimum pad ring 10mil, minimum via ring 8mil, stop-mask expansion 4mil, vias tented up to drill 0mil, thermal gap 10mil

### Footprints (pad centres in the part's own frame; a part is rotated, then mirrored left to right if it is on the bottom)
C0603 = smd 1.1 x 1: 1 -0.85,0; 2 0.85,0
E5-5 = drill 0.813 pad 1.905: + -2.54,0 | drill 0.813 pad 1.905 octagon: - 2.54,0
C0805 = smd 1.3 x 1.5: 1 -0.95,0; 2 0.95,0
LED-0603 = smd 1 x 1: A -0.877,0; C 0.877,0
2MM-5-H = drill 0.8 square: 1 -4,0 | drill 0.8: 2 -2,0; 3 0,0; 4 2,0; 5 4,0
2MM-8-V = drill 0.8 square: 1 -6,0 | drill 0.8: 2 -4,0; 3 -2,0; 4 0,0; 5 2,0; 6 4,0; 7 6,0; 8 8,0
2MM-6-V = drill 0.8 square: 1 -4,0 | drill 0.8: 2 -2,0; 3 0,0; 4 2,0; 5 4,0; 6 6,0
B2PS-CENTERED = drill 1.65 square: 1 -1.98,0 | drill 1.65: 2 1.98,0
S3B-VH = drill 1.5 octagon: 1 1.95,7.2; 2 5.91,7.2; 3 9.87,7.2
SOT23-6 = smd 0.55 x 1.2: 1 -0.95,-1.3; 2 0,-1.3; 3 0.95,-1.3; 4 0.95,1.3; 5 0,1.3; 6 -0.95,1.3
RC0805N-L = smd 0.802 x 1.2: 1 0.519,-0.762; 2 2.021,-0.762
R0603 = smd 1 x 1.1: 1 -0.85,0; 2 0.85,0
R-78E = drill 1 square: 1 -2.54,0 | drill 1: 2 0,0; 3 2.54,0
DBV5 = smd 1.473 x 0.559: 1 1.041,-0.574; 2 1.041,-1.524; 3 1.041,-2.474; 4 3.277,-2.474; 5 3.277,-0.574
SOIC-8 = smd 0.61 x 1.52: 1 -1.905,-2.723; 2 -0.635,-2.723; 3 0.635,-2.723; 4 1.905,-2.723; 5 1.905,2.723; 6 0.635,2.723; 7 -0.635,2.723; 8 -1.905,2.723
PW16-M = smd 1.981 x 0.406: 1 -2.87,2.275; 2 -2.87,1.625; 3 -2.87,0.975; 4 -2.87,0.325; 5 -2.87,-0.325; 6 -2.87,-0.975; 7 -2.87,-1.625; 8 -2.87,-2.275; 9 2.87,-2.275; 10 2.87,-1.625; 11 2.87,-0.975; 12 2.87,-0.325; 13 2.87,0.325; 14 2.87,0.975; 15 2.87,1.625; 16 2.87,2.275
SOIC8-N_MC = smd 1.981 x 0.559: 1 -2.362,1.905; 2 -2.362,0.635; 3 -2.362,-0.635; 4 -2.362,-1.905; 5 2.362,-1.905; 6 2.362,-0.635; 7 2.362,0.635; 8 2.362,1.905
SOT-23-5 = smd 0.6 x 1.2: 1 -0.95,-1.306; 2 0,-1.306; 3 0.95,-1.306; 4 0.95,1.306; 5 -0.95,1.306
SOD323 = smd 1.111 x 0.401: 1 -1.15,0; 2 1.15,0
SWERVE_MBED = drill 0.6 pad 1.016: P$1 -30.48,27.94; P$2 -30.48,25.4; P$3 -30.48,22.86; P$4 -30.48,20.32; P$5 -30.48,17.78; P$6 -30.48,15.24; P$7 -30.48,12.7; P$8 -30.48,10.16; P$9 -30.48,7.62; P$10 -30.48,5.08; P$11 -30.48,2.54; P$12 -30.48,0; P$13 -30.48,-2.54; P$14 -30.48,-5.08; P$15 -30.48,-7.62; P$16 -30.48,-10.16; P$17 -30.48,-12.7; P$18 -30.48,-15.24; P$19 -30.48,-17.78; P$20 -30.48,-20.32; P$21 -30.48,-22.86; P$22 -30.48,-25.4; P$23 -27.94,27.94; P$24 -27.94,25.4; P$25 -27.94,22.86; P$26 -27.94,20.32; P$27 -27.94,17.78; P$28 -27.94,15.24; P$29 -27.94,12.7; P$30 -27.94,10.16; P$31 -27.94,7.62; P$32 -27.94,5.08; P$33 -27.94,2.54; P$34 -27.94,0; P$35 -27.94,-2.54; P$36 -27.94,-5.08; P$37 -27.94,-7.62; P$38 -27.94,-10.16; P$39 -27.94,-12.7; P$40 -27.94,-15.24; P$41 -27.94,-17.78; P$42 -27.94,-20.32; P$43 -27.94,-22.86; P$44 -27.94,-25.4; P$45 27.94,27.94; P$46 27.94,25.4; P$47 27.94,22.86; P$48 27.94,20.32; P$49 27.94,17.78; P$50 27.94,15.24; P$51 27.94,12.7; P$52 27.94,10.16; P$53 27.94,7.62; P$54 27.94,5.08; P$55 27.94,2.54; P$56 27.94,0; P$57 27.94,-2.54; P$58 27.94,-5.08; P$59 27.94,-7.62; P$60 27.94,-10.16; P$61 27.94,-12.7; P$62 27.94,-15.24; P$63 27.94,-17.78; P$64 27.94,-20.32; P$65 27.94,-22.86; P$66 27.94,-25.4; P$67 30.48,27.94; P$68 30.48,25.4; P$69 30.48,22.86; P$70 30.48,20.32; P$71 30.48,17.78; P$72 30.48,15.24; P$73 30.48,12.7; P$74 30.48,10.16; P$75 30.48,7.62; P$76 30.48,5.08; P$77 30.48,2.54; P$78 30.48,0; P$79 30.48,-2.54; P$80 30.48,-5.08; P$81 30.48,-7.62; P$82 30.48,-10.16; P$83 30.48,-12.7; P$84 30.48,-15.24; P$85 30.48,-17.78; P$86 30.48,-20.32; P$87 30.48,-22.86; P$88 30.48,-25.4
STANDOFF-HOLE = hole 3.9: 0,0

### Placement (x,y rotation side)
C1  14.26,53.77 0 top
C2  125.66,28.27 0 top
C3  19.58,19.71 90 top
C4  124.31,86.39 0 top
C7  13.94,13.89 90 top
C8  36.36,25.2 270 top
C10  36.48,83 180 top
C11  34.95,16.51 270 top
C12  127.53,120.91 0 top
C13  21.69,64 180 top
C14  18.13,71.12 180 top
C15  18.13,73.66 180 top
C16  17.55,89.98 0 top
C17  36.12,64.14 0 top
D1  27.91,52.07 180 top
D2  27.91,36.83 180 top
D3  27.91,40.64 180 top
D4  27.91,44.45 180 top
D5  27.91,48.26 180 top
J1  134.01,22.86 90 top
J2  134.01,38.1 90 top
J3  127.66,5.08 0 top
J4  123.85,127 0 top
J5  8.53,67.31 270 top
J6  136.55,123.19 270 top
J7  8.53,97.79 270 top
J8  22.75,128.13 0 top
J9  8.53,77.47 270 top
J10  4.33,11.03 90 top
J11  4.33,28.28 90 top
J12  4.33,45.7 90 top
J13  134.01,53.34 90 top
J14  134.01,68.58 90 top
J15  8.53,87.63 270 top
J16  24.79,1.27 0 top
J17  15.9,8.89 0 top
Q4  18.8,97.79 0 top
R1  128.51,36.64 270 top
R2  128.03,21.3 270 top
R3  18.25,76.21 180 top
R4  18.13,68.58 180 top
R5  29.09,81.17 180 top
R6  11.2,32.32 180 top
R7  13.02,20.48 180 top
R8  11.45,49.77 0 top
R9  128.5,67 270 top
R10  128.25,52 270 top
R11  34.27,52.07 0 top
R12  34.27,36.83 0 top
R13  24.79,16.51 270 top
R14  29.87,16.51 90 top
R15  18.95,13.66 90 top
R18  34.27,40.64 0 top
R19  34.27,44.45 0 top
R21  34.27,48.26 0 top
R25  23.75,97.87 180 top
T1  30.83,64.77 90 top
U1  120.89,36.64 0 top
U2  120.41,21.3 0 top
U3  120.62,52 0 top
U4  31.52,96.02 90 top
U5  28.29,74.93 180 top
U6  126.12,12.22 0 top
U7  120.88,67 0 top
U8  120.12,79.64 90 top
U9  12.59,82.55 0 top
U$1  78.13,72.39 0 top
U$2  [STANDOFF-HOLE]  10.57,113.83 0 top
U$3  [STANDOFF-HOLE]  18.57,30.08 0 top
U$4  [STANDOFF-HOLE]  128.07,106.33 0 top
U$5  [STANDOFF-HOLE]  125.44,43.7 0 top
U$6  [12V]  10.44,90.98 270 top
U$7  [12V]  10.44,80.61 270 top
U$10  [ROBOBUZZ_1.4X]  75.67,18.93 0 top
U$12  [SAFETY]  10.3,103.28 270 top

### Tracks (layer width: path | path; a pad name or v marks a point on that pad's centre or on a via)
3V3_LED_R
  Top 0.152: D5.A R21.1
5V_LED_R
  Top 0.152: D4.A R19.1
12V_LED_R
  Top 0.152: D3.A R18.1
+3V3  (via drill 0.35)
  Top 0.152: C10.1 37.44,81.71 v38.19,80.95 | v42.44,53.33 37.37,48.26 R21.2
  Bottom 0.152: U$1.P$30 48.59,80.95 v38.19,80.95 | v42.44,53.33 v42.44,71.2
  pour Top: 40.19,131.45 119.69,131.45 119.69,115.95 119.69,56.45 114.69,56.45 40.19,56.45
+5V  (via drill 0.35)
  Top 0.152: T1.3 32.42,67.31 35.17,64.56 C17.1 35.17,55.1 | U5.15 27.72,73.3 30.83,70.19 T1.3 | R3.2 16.06,76.2 12.69,72.83 12.69,63.99 | 12.69,63.99 v12.69,62.33 | C13.1 25.86,67.31 T1.3 | R4.2 12.69,63.99
  Bottom 0.152: v12.69,62.33 12.69,54.83 v11.69,53.83
  pour Top: 0.44,55.58 120.19,55.58 120.19,130.83 142.56,130.83 142.56,-0.05 0.44,-0.05
+5V_ENCODER1
  Top 0.152: J14.2 127.84,66.58 127.76,66.51 | 127.76,66.51 R9.1 | U7.5 124.24,66.51 127.76,66.51
+5V_ENCODER2
  Top 0.152: J13.2 127.63,51.34 R10.1 127.43,51.43 U3.5
+5V_ENCODER3
  Top 0.152: U1.5 124.23,36.12 R1.1 127.77,36.1 J2.2
+5V_ENCODER4
  Top 0.152: U2.5 123.75,20.78 R2.1 127.36,20.86 J1.2
+12V  (via drill 0.35)
  Top 0.152: R18.2 36.69,42.22 v36.69,46.7
  Bottom 0.152: v36.69,46.7 37.06,47.08 37.06,58.08 32.91,62.23 T1.1
  pour Top: 0.44,131.33 39.56,131.33 39.56,56.2 0.56,56.2 0.31,56.2 0.31,131.33
+24V
  Top 0.152: J16.1 26.74,13.71 R13.2 24.79,15.99 24.01,16.77 24.01,25.73 R12.2
BATTIN
  Top 0.152: R13.1 R14.2 C11.1 55.19,37.6 55.19,57.2 50.19,62.2 U$1.P$38
CAN_N
  Top 0.152: U6.6 130.69,11.59 133.66,8.61 J3.7
CAN_P
  Top 0.152: U6.7 130.66,12.85 135.66,7.86 J3.8
DIAG_RX  (via drill 0.35)
  Top 0.152: v109.69,20.2 112.27,20.2 122.67,9.81 126.93,9.81 J3.6 | v107.56,36.2 107.56,68.8 U$1.P$79
  Bottom 0.152: v109.69,20.2 109.69,34.08 v107.56,36.2
DIAG_TX  (via drill 0.35)
  Top 0.152: J3.5 125.24,9.5 119.53,9.5 99.56,29.47 v99.56,67.2 | U$1.P$58 105.97,67.2 v103.56,67.2
  Bottom 0.152: v103.56,67.2 v99.56,67.2
EA1
  Top 0.152: J14.3 117.5,68.58 U$1.P$83
EA2
  Top 0.152: J13.3 129.43,53.34 125.62,57.15 U$1.P$84
EA3
  Top 0.152: J2.3 124.67,38.1 108.61,54.16 U$1.P$85
EA4
  Top 0.152: J1.3 126.03,22.86 112.94,35.95 112.94,48.58 109.45,52.07 U$1.P$86
EB1  (via drill 0.35)
  Top 0.152: J14.1 129.88,60.45 v113.56,60.45
  Bottom 0.152: v113.56,60.45 108.95,60.45 108.93,60.47 106.85,60.47 U$1.P$61
EB2  (via drill 0.35)
  Top 0.152: J13.1 132.62,47.95 119.06,47.95 v115.44,51.58
  Bottom 0.152: v115.44,51.58 111.06,55.95 106.81,55.95 106.07,56.7 U$1.P$62
EB3  (via drill 0.35)
  Top 0.152: J2.1 132.09,34.1 129.44,31.45 119.19,31.45 113.94,36.7 v113.94,47.33
  Bottom 0.152: v113.94,47.33 113.94,49.95 110.81,53.08 106.94,53.08 106.07,53.95 U$1.P$63
EB4
  Top 0.152: J1.1 131.22,18.86 128.81,16.45 120.31,16.45 104.31,32.45 104.31,50.31 U$1.P$64
ENCODER1_SENSE  (via drill 0.35)
  Top 0.152: U7.1 121.83,66.33 v117.69,66.33
  Bottom 0.152: v117.69,66.33 117.69,14.58 121.69,10.58 121.69,5.11 J3.1
ENCODER2_SENSE  (via drill 0.35)
  Top 0.152: U3.1 120.31,52.78 v120.31,53.83
  Bottom 0.152: v120.31,53.83 120.31,18.2 123.81,14.7 123.81,5.23 J3.2
ENCODER3_SENSE  (via drill 0.35)
  Top 0.152: U1.1 v121.94,39.33
  Bottom 0.152: v121.94,39.33 121.94,19.45 125.69,15.7 125.69,5.11 J3.3
ENCODER4_SENSE  (via drill 0.35)
  Top 0.152: U2.1 121.46,21.85 v122.56,22.95
  Bottom 0.152: v122.56,22.95 127.66,17.86 J3.4
ESTOP  (via drill 0.35)
  Top 0.152: v52.69,88.7 51.27,88.7 U$1.P$28 | J5.2 11.56,68.36 11.56,74.08 25.31,87.83 v37.06,87.83
  Bottom 0.152: v37.06,87.83 37.94,88.7 v52.69,88.7
GND  (via drill 0.35)
  Top 0.152: R14.1 29.94,15.59 v29.94,13.7 | C11.2 v34.95,13.71 v34.94,13.7 | C7.2 13.94,15.84 v14.69,16.58 | R7.1 15.54,20.48 v15.69,20.33 | R6.1 13.45,32.32 v13.94,31.83 | R8.2 14,49.77 v14.44,49.33 | v27.81,34.33 27.04,35.11 D2.C D3.C D4.C D5.C D1.C 27.04,53.68 v27.69,54.33 | U6.8 131.14,14.12 v131.56,13.7 | U6.2 121.47,12.85 v121.31,12.7 | U2.2 119.76,19.77 v119.31,19.33 | U1.2 119.6,35.12 v119.19,34.7 | U3.2 119.72,50.48 v119.31,50.08 | U7.2 119.33,65.47 v118.69,64.83 | C15.2 17.2,73.58 v15.19,73.58 | C14.2 17.11,70.95 v15.19,70.95 | U5.10 U5.9 v22.94,77.2 | U4.3 U4.2 35.89,95.38 v35.94,95.33 | U9.2 14.47,82.55 v15.31,81.7 | U5.7 33.54,76.55 v33.69,76.7 | U5.2 33.34,73.3 v33.69,72.95 | R5.2 28.14,81.08 v26.31,81.08 | C8.2 34.94,22.84 v34.94,21.95 | C16.2 20.04,89.98 v20.81,89.2 | U8.2 123.38,79.64 v123.69,79.33 | C10.2 35.53,81.36 v36.06,80.83 | C17.2 37.62,64.14 v38.94,62.83 | C4.2 126.5,86.39 v127.31,85.58 | C12.2 128.73,120.91 v129.69,119.95 | v16.94,54.7 16.05,54.7 C1.2 | C2.2 127.12,28.27 v127.81,27.58 | C13.2 20.84,63.11 v20.06,62.33 | U$1.P$11 U$1.P$12
  pour Bottom: -0.12,130.81 142.9,130.81 142.9,0 -0.12,0
INDICATOR_LED  (via drill 0.35)
  Top 0.152: R11.2 38.08,52.07 v38.19,51.95 | v52.44,53.2 52.44,54.9 U$1.P$40
  Bottom 0.152: v38.19,51.95 45.44,51.95 46.69,53.2 v52.44,53.2
LIDAR_EN_1_3V3  (via drill 0.35)
  Top 0.152: U5.4 33.66,74.61 v33.69,74.58 | v36.31,72.7 44.25,64.77 U$1.P$15
  Bottom 0.152: v33.69,74.58 34.44,74.58 v36.31,72.7
LIDAR_EN_1_5V  (via drill 0.35)
  Top 0.152: J12.5 10.54,49.7 R8.1 10.6,51.86 v10.69,51.95 | v23.18,74.46 23.32,74.61 U5.13
  Bottom 0.152: v10.69,51.95 10.69,62.1 23.06,74.46 v23.18,74.46
LIDAR_EN_2_3V3
  Top 0.152: U5.3 38.06,73.95 45.94,66.08 49.06,66.08 50.19,64.95 U$1.P$37
LIDAR_EN_2_5V  (via drill 0.35)
  Top 0.152: J11.5 10.31,32.28 R6.2 10.35,34.49 v10.81,34.95 | v22.24,72.66 23.53,73.95 U5.14
  Bottom 0.152: v10.81,34.95 10.81,42.08 22.24,53.5 v22.24,72.66
LIDAR_EN_3_3V3
  Top 0.152: U5.1 41.58,62.23 U$1.P$16
LIDAR_EN_3_5V  (via drill 0.35)
  Top 0.152: v12.81,23.33 12.16,22.68 R7.2 10.52,18.83 v10.44,18.83 | v23.31,71.7 24.27,72.66 U5.16
  Bottom 0.152: v12.81,23.33 12.81,43.02 22.79,53 22.79,71.18 v23.31,71.7 | v10.44,18.83 6.64,15.03 J10.5
LVL_SHIFT_OE  (via drill 0.35)
  Top 0.152: R5.1 31.16,79.95 U5.8 31.66,77.7 v33.69,77.7 | v41.44,54.7 47.55,54.7 U$1.P$19
  Bottom 0.152: v33.69,77.7 32.94,76.95 32.94,66.7 41.44,58.2 v41.44,54.7
MBED_CAN_RD
  Top 0.152: U$1.P$57 104.46,69.85 101.56,66.95 101.56,33.6 121.04,14.12 U6.1
MBED_CAN_TD
  Top 0.152: U6.4 123,11.08 122.08,11.08 100.69,32.47 100.69,67.95 103.69,70.95 107.44,70.95 108.61,72.12 U$1.P$78
MCTRL1_RX  (via drill 0.35)
  Top 0.152: v58.19,72.45 65.31,72.45 82.81,89.97 v82.81,90.08 | v53.69,72.45 50.25,72.45 U$1.P$34
  Bottom 0.152: v58.19,72.45 v53.69,72.45 | v82.81,90.08 119.73,127 J4.1
MCTRL1_TX  (via drill 0.35)
  Top 0.152: v57.56,86.33 57.44,86.2 48.77,86.2 U$1.P$7
  Bottom 0.152: v57.56,86.33 57.69,86.2 81.31,86.2 121.85,126.74 J4.2
MCTRL2_RX  (via drill 0.35)
  Top 0.152: v57.56,46.95 65.94,55.33 65.94,66.58 v77.81,78.45 | v53.81,46.95 50.22,46.95 U$1.P$44
  Bottom 0.152: v57.56,46.95 v53.81,46.95 | v77.81,78.45 125.85,126.49 J4.4
MCTRL2_TX  (via drill 0.35)
  Top 0.152: v57.69,44.2 67.06,53.58 67.06,66.22 78.93,78.08 v79.06,78.08 | v47.69,44.2 47.69,46.95 U$1.P$22
  Bottom 0.152: v57.69,44.2 v47.69,44.2 | v79.06,78.08 127.85,126.86 J4.5
MCTRL3_RX
  Bottom 0.152: J6.1 136.55,126.44 135.67,125.56 135.67,105.68 107.45,77.47 U$1.P$54
MCTRL3_TX  (via drill 0.35)
  Top 0.152: v137.43,106.29 137.43,124.31 J6.2
  Bottom 0.152: U$1.P$76 v137.43,106.29
MCTRL4_RX
  Top 0.152: J6.4 133.93,121.19 115.56,102.83 115.56,87.7 111.44,83.58 107.1,83.58 U$1.P$52
MCTRL4_TX
  Top 0.152: J6.5 133.3,119.19 117.44,103.33 117.44,85.2 112.25,80.01 U$1.P$75
N$1
  Top 0.152: D2.A R12.1
N$2
  Top 0.152: D1.A R11.1
N$3
  Top 0.152: C7.1 13.94,8.91 J17.1
NR  (via drill 0.35)
  Top 0.152: J17.2 18.95,9.96 R15.1 21.69,15.55 v21.69,15.58 | v49.06,29.45 55.94,36.33 55.94,79.34 U$1.P$29
  Bottom 0.152: v21.69,15.58 35.56,29.45 v49.06,29.45
SAFETY_HRD
  Top 0.152: J7.2 17.17,95.81 Q4.1 Q4.2 Q4.5 Q4.6
SAFETY_LIGHT  (via drill 0.35)
  Top 0.152: R25.1 24.65,97.92 U4.5 29.53,97.18 29.65,97.18 30.81,96.02 v30.81,90.08 | v38.31,58.7 46.09,58.7 U$1.P$18
  Bottom 0.152: v38.31,58.7 38.31,60.9 32.63,66.58 32.63,90.08 v30.81,90.08
SAFETY_R
  Top 0.152: Q4.3 21.13,97.87 R25.2
SCL_3V3  (via drill 0.35)
  Top 0.152: U5.5 34.77,75.25 v35.06,74.95
  Bottom 0.152: v35.06,74.95 45.31,74.95 46.69,73.58 85.69,73.58 107.36,95.25 U$1.P$69
SCL_5V  (via drill 0.35)
  Top 0.152: U5.12 23.11,75.25 C14.1 R4.1 18.98,64.16 v19.06,64.08 | v15.94,49.2 13.56,46.83 5.45,46.83 J12.3 3.45,44.82 3.45,29.91 4.33,29.03 J11.3
  Bottom 0.152: v19.06,64.08 19.06,52.33 v15.94,49.2 | J10.3 4.33,11.78 3.45,12.67 3.45,24.57 3.44,24.58 3.44,27.39 J11.3
SDA_3V3  (via drill 0.35)
  Top 0.152: U5.6 35.02,75.91 v35.06,75.95
  Bottom 0.152: U$1.P$47 86.78,75.95 v35.06,75.95
SDA_5V  (via drill 0.35)
  Top 0.152: R3.1 18.98,76.09 C15.1 | C15.1 21.22,75.91 U5.11 | v8.69,44.7 5.33,44.7 J12.2 6.19,41.84 v6.19,33.7 | v18.06,65.95 18.06,72.75 C15.1 | v6.19,30.83 6.19,28.14 J11.2 6.14,24.47 6.14,12.56 J10.2
  Bottom 0.152: v8.69,44.7 18.06,54.08 v18.06,65.95 | v6.19,33.7 v6.19,30.83
STATUS_LED1  (via drill 0.35)
  Top 0.152: J8.2 45.31,107.55 v45.31,71.33 | v45.31,53.33 46.58,52.07 U$1.P$20
  Bottom 0.152: v45.31,71.33 v45.31,53.33
STATUS_LED2  (via drill 0.35)
  Top 0.152: J8.1 43.94,104.96 v43.94,71.33 | v43.94,53.33 43.94,53.24 U$1.P$21
  Bottom 0.152: v43.94,71.33 v43.94,53.33

### Text on the board
tPlace: MCTRL | ENCODER #1 | ESTOP | #2 | LIDAR #1 | ERR | 3V3 | 5V | 12V | #3 | 24V | #2 | #4 | #3 | DIAG